# EAGLE schematic thick (EAGLE 9.6.2)
CNAME: Thicker PCB; CREVISION: 1; DESIGNER: Székely Flórián
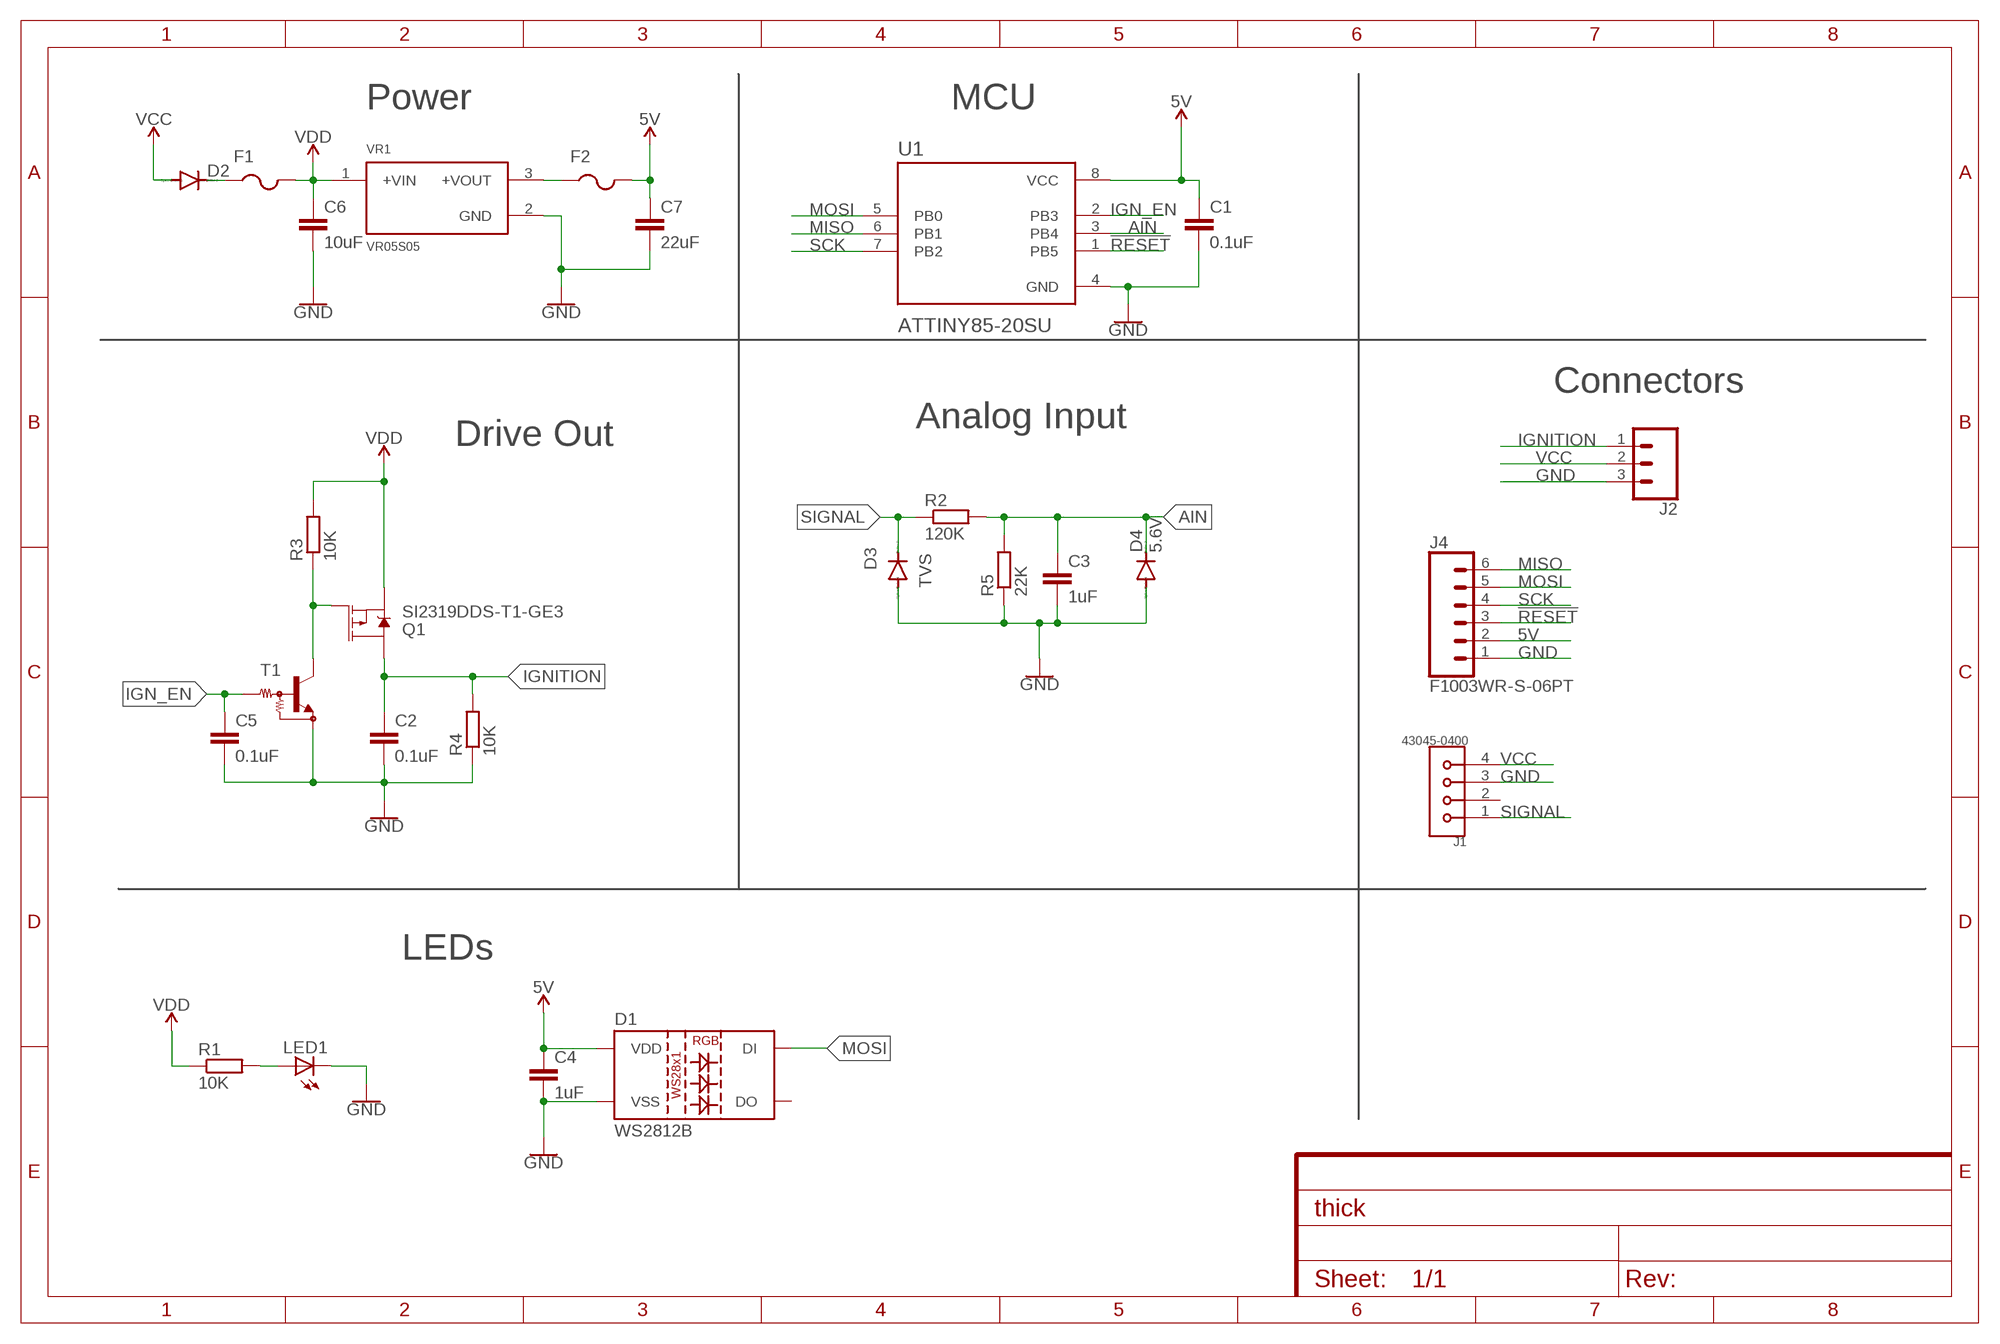
[diagram p0: schematic, sheet 1]

## Parts
C1  0.1uF  C-EUC0603  [C0603]
C2  0.1uF  C-EUC0603  [C0603]
C3  1uF  C-EUC0603  [C0603]
C4  1uF  C-EUC0603  [C0603]
C5  0.1uF  C-EUC0603  [C0603]
C6  10uF  C-EUC1206  [C1206]
C7  22uF  C-EUC0603  [C0603]
D1  WS2812B  [WS2812B]
D2  DIODE-MINIMELF  [MINIMELF]
D3  TVS  DIODE-DO214AC  [DO214AC]
D4  5.6V  DIODE-MINIMELF  [MINIMELF]
F1  PTCFUSE-1206  [R1206]
F2  PTCFUSE-1206  [R1206]
J1  43045-0400  [MOLEX_43045-0400]
J2  CONN_03LONGPADS  [1X03_LONGPADS]
J4  F1003WR-S-06PT  [1X06-1MM]
LED1  LEDCHIPLED_0805  [CHIPLED_0805]
Q1  SI2319DDS-T1-GE3  MOSFET_PCH-DMG2307L  [SOT23-3]
R1  10K  R-EU_R0603  [R0603]
R2  120K  R-EU_R0603  [R0603]
R3  10K  R-EU_R0603  [R0603]
R4  10K  R-EU_R0603  [R0603]
R5  22K  R-EU_R0603  [R0603]
T1  MUN2213T1-NPN_DRIVER-SC59-BEC  [SC59-BEC]
U1  ATTINY85-20SU  [SOIC127P798X216-8N]
VR1  VR05S05  TSR_1-24150  [CONV_TSR_1-24150]

## Nets
5V: C1.1 C4.1 C7.1 D1.1(VDD) F2.2 J4.2 U1.8(VCC)
!RESET: J4.3 U1.1(PB5)
AIN: C3.1 D4.C R2.2 R5.2 U1.3(PB4)
GND: C1.2 C2.2 C3.2 C4.2 C5.2 C6.2 C7.2 D1.3(VSS) D3.A D4.A J1.3 J2.3 J4.1 LED1.C R4.1 R5.1 T1.E U1.4(GND) VR1.2(GND)
IGN_EN: C5.1 T1.B U1.2(PB3)
IGNITION: C2.1 J2.1 Q1.3(D) R4.2
MISO: J4.6 U1.6(PB1)
MOSI: D1.4(DI) J4.5 U1.5(PB0)
N$1: Q1.1(G) R3.1 T1.C
N$3: LED1.A R1.2
N$4: F2.1 VR1.3(+VOUT)
N$11: D2.C F1.1
SCK: J4.4 U1.7(PB2)
SIGNAL: D3.C J1.1 R2.1
VCC: D2.A J1.4 J2.2
VDD: C6.1 F1.2 Q1.2(S) R1.1 R3.2 VR1.1(+VIN)
Unconnected: D1.2(DO) J1.2

## Notes on the sheet
- Power | MCU
- Connectors
- Analog Input
- Drive Out
- LEDs

## Library data of the parts
C1-C7 = resistor:C-EU: CAPACITOR, European symbol
D1 = SparkFun-LED:WS2812B: WS2812B SMD addressable RGB LED 5x5mm SMD LED with built-in controller IC. Color: Red/Green/Blue mC Rating: RGB: 390, 660, 180 mcd Forward Voltage: RGB: 2.0, 3.0, 3.0 V Packages:WS2812B SparkFun Products: Blynk Board - ESP8266 <https://www.sparkfun.com/products/13794>; PROD_ID: DIO-12503
D2-D4 = diode:DIODE-: DIODE
F1 F2 = adafruit:PTCFUSE: PTC fuses, resettable thermistors
J1 = 43045-0400:43045-0400: Conn Micro-Fit 2x2 Way Header 3mm Pitch r/Angle Ti Check prices <https://pricing.snapeda.com/parts/43045-0400/Molex/view-part?ref=eda>; AVAILABILITY: Warning; DESCRIPTION: Connector Header Through Hole, Right Angle 4 position 0.118 (3.00mm); MF: Molex; MP: 43045-0400; PACKAGE: None; PRICE: None; PURCHASE-URL: https://pricing.snapeda.com/search/part/43045-0400/?ref=eda
J2 = SparkFun-Connectors:CONN_03: Multi connection point. Often used as Generic Header-pin footprint for 0.1 inch spaced/style header connections On any of the 0.1 inch spaced packages, you can populate with these: Break Away Headers - Straight <https://www.sparkfun.com/products/116> (PRT-00116) Break Away Male Headers - Right Angle <https://www.sparkfun.com/products/553> (PRT-00553) Female Headers <https://www.sparkfun.com/products/115> (PRT-00115) Break Away Headers - Machine Pin <https://www.sparkfun.com/products/117> (PRT-00117) Break Away Female Headers - Swiss Machine Pin <https://www.sparkfun.com/products/743> (PRT-00743) Stackable Header - 3 Pin (Female, 0.1") <https://www.sparkfun.com/products/13875> (PRT-13875) For SCREWTERMINALS and SPRING TERMINALS visit here: Screw Terimnals on SparkFun.com <https://www.sparkfun.com/search/results?term=Screw+Terminals> (5mm/3.5mm/2.54mm spacing) This device is also useful as a general connection point to wire up your design to another part of your project. Our various solder wires solder well into these plated through hole pads. Hook-Up Wire - Assortment (Stranded, 22 AWG) <https://www.sparkfun.com/products/11375> (PRT-11375) Hook-Up Wire - Assortment (Solid Core, 22 AWG) <https://www.sparkfun.com/products/11367> (PRT-11367) View the entire wire category on our website here <https://www.sparkfun.com/categories/141> Special notes: Molex polarized connector foot print use with SKU : PRT-08232 with associated crimp pins and housings.
J4 = FloManEagle:F1003WR-S-06PT
LED1 = adafruit:LED: LED OSRAM: - CHIPLED LG R971, LG N971, LY N971, LG Q971, LY Q971, LO R971, LY R971 LH N974, LH R974 LS Q976, LO Q976, LY Q976 LO Q996 - Hyper CHIPLED LW Q18S LB Q993, LB Q99A, LB R99A - SideLED LS A670, LO A670, LY A670, LG A670, LP A670 LB A673, LV A673, LT A673, LW A673 LH A674 LY A675 LS A676, LA A676, LO A676, LY A676, LW A676 LS A679, LY A679, LG A679 - Hyper Micro SIDELED® LS Y876, LA Y876, LO Y876, LY Y876 LT Y87S - SmartLED LW L88C, LW L88S LB L89C, LB L89S, LG L890 LS L89K, LO L89K, LY L89K LS L896, LA L896, LO L896, LY L896 - TOPLED LS T670, LO T670, LY T670, LG T670, LP T670 LSG T670, LSP T670, LSY T670, LOP T670, LYG T670 LG T671, LOG T671, LSG T671 LB T673, LV T673, LT T673, LW T673 LH T674 LS T676, LA T676, LO T676, LY T676, LB T676, LH T676, LSB T676, LW T676 LB T67C, LV T67C, LT T67C, LS T67K, LO T67K, LY T67K, LW E67C LS E67B, LA E67B, LO E67B, LY E67B, LB E67C, LV E67C, LT E67C LW T67C LS T679, LY T679, LG T679 LS T770, LO T770, LY T770, LG T770, LP T770 LB T773, LV T773, LT T773, LW T773 LH T774 LS E675, LA E675, LY E675, LS T675 LS T776, LA T776, LO T776, LY T776, LB T776 LHGB T686 LT T68C, LB T68C - Hyper Mini TOPLED® LB M676 - Mini TOPLED Santana® LG M470 LS M47K, LO M47K, LY M47K Source: http://www.osram.convergy.de/
Q1 = SparkFun-DiscreteSemi:MOSFET_PCH: P-channel MOSFETs Voltage controlled devices that allow control of high current outputs. SparkFun Products: SparkFun ESP32 Thing <https://www.sparkfun.com/products/13907> SparkFun ESP8266 Thing <https://www.sparkfun.com/products/13231>; PROD_ID: TRANS-11308; VALUE: 2.5A/30V/105mΩ
R1-R5 = resistor:R-EU_: RESISTOR, European symbol
T1 = transistor:*-NPN_DRIVER-: NPN Bias Resistor Transistor
U1 = ATTINY85-20SU:ATTINY85-20SU: AVR AVR® ATtiny, Functional Safety (FuSa) Microcontroller IC 8-Bit 20MHz 8KB (4K x 16) FLASH 8-SOIC Check prices <https://pricing.snapeda.com/parts/ATTINY85-20SU/Microchip%20Technology/view-part?ref=eda>; AVAILABILITY: Warning; DESCRIPTION: AVR AVR® ATtiny, Functional Safety (FuSa) Microcontroller IC 8-Bit 20MHz 8KB (4K x 16) FLASH 8-SOIC; MF: Microchip Technology; MP: ATTINY85-20SU; PACKAGE: SOIC-8 Microchip; PRICE: None; PURCHASE-URL: https://pricing.snapeda.com/search/part/ATTINY85-20SU/?ref=eda
VR1 = TSR_1-24150:TSR_1-24150: Linear Regulator Replacement DC DC Converter 1 Output 12V 1A 15V - 36V Input Check prices <https://pricing.snapeda.com/parts/TSR%201-24150/Traco%20Power/view-part?ref=eda>; AVAILABILITY: Warning; DESCRIPTION: Linear Regulator Replacement DC DC Converter 1 Output 15V 1A 18V - 36V Input; MF: Traco Power; MP: TSR 1-24150; PACKAGE: SIP-3 Tracopower; PRICE: None; PURCHASE-URL: https://pricing.snapeda.com/search/part/TSR 1-24150/?ref=eda